# Altium schematic sheet AMC_uBACKPLANE.SchDoc: AMC uBACKPLANE
size 420 x 297 mm; Organization: Altium Limited; Address1: L3, 12a Rodborough Rd; Address2: Frenchs Forest; Address3: NSW; Address4: Australia 2086; DocumentNumber: 12; SheetNumber: 1; SheetTotal: 15
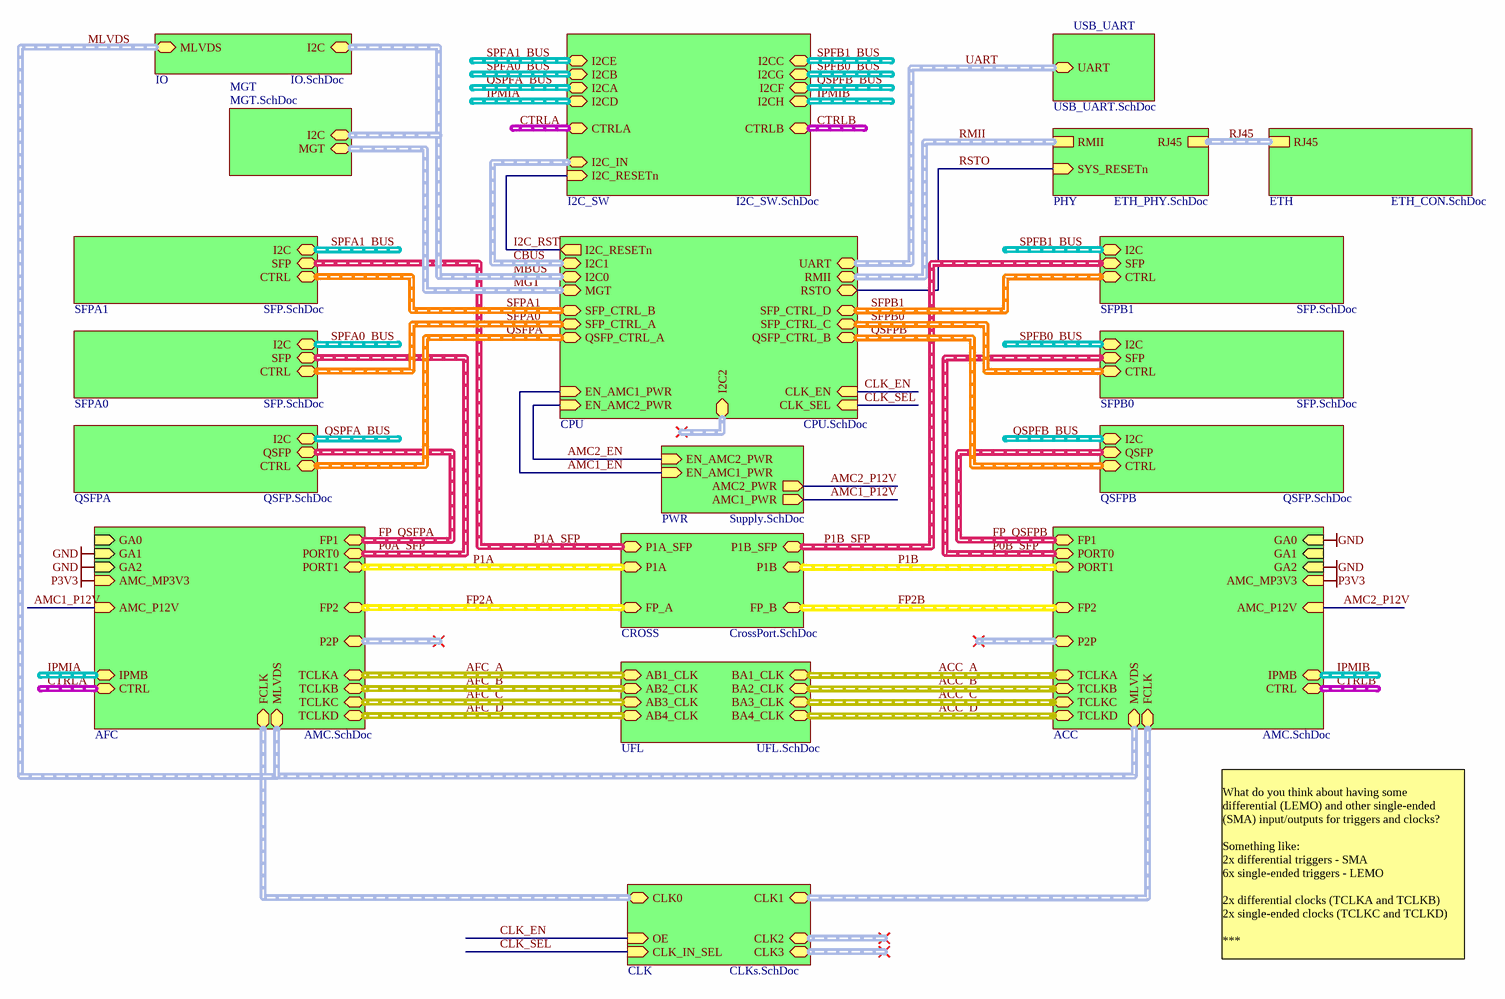
[diagram p0: AMC_uBACKPLANE.SchDoc]

## Sub-sheets
ACC = AMC.SchDoc: GA0 (in), GA1 (in), GA2 (in), MLVDS (harness TRG), PORT0 (harness 1xLane), FP2 (harness FP), PORT1 (harness 1xLane), FCLK (harness CLK_DF), TCLKA (harness CLK_DF), TCLKB (harness CLK_DF), TCLKC (harness CLK_DF), TCLKD (harness CLK_DF), FP1 (harness FP), AMC_P12V (in), AMC_MP3V3 (in), IPMB (harness I2C), CTRL (harness AMC_CTRL), P2P (harness P2P)
AFC = AMC.SchDoc: GA0 (in), GA1 (in), GA2 (in), MLVDS (harness TRG), PORT0 (harness 1xLane), FP2 (harness FP), PORT1 (harness 1xLane), FCLK (harness CLK_DF), TCLKA (harness CLK_DF), TCLKB (harness CLK_DF), TCLKC (harness CLK_DF), TCLKD (harness CLK_DF), FP1 (harness FP), AMC_P12V (in), AMC_MP3V3 (in), IPMB (harness I2C), CTRL (harness AMC_CTRL), P2P (harness P2P)
CLK = CLKs.SchDoc: CLK_IN_SEL (in), OE (in), CLK0 (harness CLK_DF), CLK1 (harness CLK_DF), CLK2 (harness CLK_DF), CLK3 (harness CLK_DF)
CPU = CPU.SchDoc: SFP_CTRL_A (harness SFP_CTRL), SFP_CTRL_B (harness SFP_CTRL), SFP_CTRL_C (harness SFP_CTRL), SFP_CTRL_D (harness SFP_CTRL), QSFP_CTRL_A (harness QSFP_CTRL), QSFP_CTRL_B (harness QSFP_CTRL), EN_AMC2_PWR (in), EN_AMC1_PWR (in), CLK_SEL (in), CLK_EN (in), I2C1 (harness I2C), I2C0 (harness I2C), I2C2 (harness I2C), UART (harness UART), RSTO, RMII (harness RMII), MGT (harness THERM_MGT), I2C_RESETn (out)
CROSS = CrossPort.SchDoc: FP_A (harness FP), FP_B (harness FP), P1A (harness 1xLane), P1A_SFP (harness 1xLane), P1B (harness 1xLane), P1B_SFP (harness 1xLane)
ETH = ETH_CON.SchDoc: RJ45 (harness MEDIA)
I2C_SW = I2C_SW.SchDoc: I2C_RESETn (in), I2CE (harness I2C), I2CB (harness I2C), I2CA (harness I2C), I2CD (harness I2C), I2CC (harness I2C), I2CG (harness I2C), I2CF (harness I2C), I2CH (harness I2C), I2C_IN (harness I2C), CTRLA (harness AMC_CTRL), CTRLB (harness AMC_CTRL)
IO = IO.SchDoc: MLVDS (harness MLVDS), I2C (harness I2C)
MGT = MGT.SchDoc: I2C (harness I2C), MGT (harness THERM_MGT)
PHY = ETH_PHY.SchDoc: RMII (harness RMII), RJ45 (harness MEDIA), SYS_RESETn (in)
PWR = Supply.SchDoc: AMC1_PWR (out), AMC2_PWR (out), EN_AMC1_PWR (in), EN_AMC2_PWR (in)
QSFPA = QSFP.SchDoc: I2C (harness I2C), QSFP (harness FP), CTRL (harness QSFP_CTRL)
QSFPB = QSFP.SchDoc: I2C (harness I2C), QSFP (harness FP), CTRL (harness QSFP_CTRL)
SFPA0 = SFP.SchDoc: I2C (harness I2C), SFP (harness 1xLane), CTRL (harness SFP_CTRL)
SFPA1 = SFP.SchDoc: I2C (harness I2C), SFP (harness 1xLane), CTRL (harness SFP_CTRL)
SFPB0 = SFP.SchDoc: I2C (harness I2C), SFP (harness 1xLane), CTRL (harness SFP_CTRL)
SFPB1 = SFP.SchDoc: I2C (harness I2C), SFP (harness 1xLane), CTRL (harness SFP_CTRL)
UFL = UFL.SchDoc: AB1_CLK (harness CLK_DF), BA1_CLK (harness CLK_DF), AB2_CLK (harness CLK_DF), BA2_CLK (harness CLK_DF), AB3_CLK (harness CLK_DF), BA3_CLK (harness CLK_DF), AB4_CLK (harness CLK_DF), BA4_CLK (harness CLK_DF)
USB_UART = USB_UART.SchDoc: UART (harness UART)

## Nets
GND: sheet ACC/GA0, sheet ACC/GA2, sheet AFC/GA1, sheet AFC/GA2
P3V3: sheet ACC/AMC_MP3V3, sheet AFC/AMC_MP3V3
AMC1_EN: sheet CPU/EN_AMC1_PWR, sheet PWR/EN_AMC1_PWR
AMC1_P12V: sheet AFC/AMC_P12V, sheet PWR/AMC1_PWR
AMC2_EN: sheet CPU/EN_AMC2_PWR, sheet PWR/EN_AMC2_PWR
AMC2_P12V: sheet ACC/AMC_P12V, sheet PWR/AMC2_PWR
CLK_EN: sheet CPU/CLK_EN, sheet CLK/OE
CLK_SEL: sheet CPU/CLK_SEL, sheet CLK/CLK_IN_SEL
I2C_RST: sheet CPU/I2C_RESETn, sheet I2C_SW/I2C_RESETn
RSTO: sheet CPU/RSTO, sheet PHY/SYS_RESETn

## Buses and harness runs
harness ACC_A = sheet ACC/TCLKA = sheet UFL/BA1_CLK
harness ACC_B = sheet ACC/TCLKB = sheet UFL/BA2_CLK
harness ACC_C = sheet ACC/TCLKC = sheet UFL/BA3_CLK
harness ACC_D = sheet ACC/TCLKD = sheet UFL/BA4_CLK
harness AFC_A = sheet AFC/TCLKA = sheet UFL/AB1_CLK
harness AFC_B = sheet AFC/TCLKB = sheet UFL/AB2_CLK
harness AFC_C = sheet AFC/TCLKC = sheet UFL/AB3_CLK
harness AFC_D = sheet AFC/TCLKD = sheet UFL/AB4_CLK
harness CBUS = sheet CPU/I2C1 = sheet I2C_SW/I2C_IN
harness CTRLA = sheet AFC/CTRL
harness CTRLA = sheet I2C_SW/CTRLA
harness CTRLB = sheet ACC/CTRL
harness CTRLB = sheet I2C_SW/CTRLB
harness FP2A = sheet AFC/FP2 = sheet CROSS/FP_A
harness FP2B = sheet ACC/FP2 = sheet CROSS/FP_B
harness FP_QSFPA = sheet AFC/FP1 = sheet QSFPA/QSFP
harness FP_QSFPB = sheet ACC/FP1 = sheet QSFPB/QSFP
harness IPMIA = sheet AFC/IPMB
harness IPMIA = sheet I2C_SW/I2CD
harness IPMIB = sheet ACC/IPMB
harness IPMIB = sheet I2C_SW/I2CH
harness MBUS = sheet CPU/I2C0 = sheet IO/I2C = sheet MGT/I2C
harness MGT = sheet CPU/MGT = sheet MGT/MGT
harness MLVDS = sheet ACC/MLVDS = sheet AFC/MLVDS = sheet IO/MLVDS
harness P0A_SFP = sheet AFC/PORT0 = sheet SFPA0/SFP
harness P0B_SFP = sheet ACC/PORT0 = sheet SFPB0/SFP
harness P1A = sheet AFC/PORT1 = sheet CROSS/P1A
harness P1A_SFP = sheet CROSS/P1A_SFP = sheet SFPA1/SFP
harness P1B = sheet ACC/PORT1 = sheet CROSS/P1B
harness P1B_SFP = sheet CROSS/P1B_SFP = sheet SFPB1/SFP
harness QSFPA = sheet CPU/QSFP_CTRL_A = sheet QSFPA/CTRL
harness QSFPB = sheet CPU/QSFP_CTRL_B = sheet QSFPB/CTRL
harness QSPFA_BUS = sheet I2C_SW/I2CA
harness QSPFA_BUS = sheet QSFPA/I2C
harness QSPFB_BUS = sheet I2C_SW/I2CF
harness QSPFB_BUS = sheet QSFPB/I2C
harness RJ45 = sheet ETH/RJ45 = sheet PHY/RJ45
harness RMII = sheet CPU/RMII = sheet PHY/RMII
harness SFPA0 = sheet CPU/SFP_CTRL_A = sheet SFPA0/CTRL
harness SFPA1 = sheet CPU/SFP_CTRL_B = sheet SFPA1/CTRL
harness SFPB0 = sheet CPU/SFP_CTRL_C = sheet SFPB0/CTRL
harness SFPB1 = sheet CPU/SFP_CTRL_D = sheet SFPB1/CTRL
harness sheet ACC/FCLK = sheet CLK/CLK1
harness sheet AFC/FCLK = sheet CLK/CLK0
harness SPFA0_BUS = sheet I2C_SW/I2CB
harness SPFA0_BUS = sheet SFPA0/I2C
harness SPFA1_BUS = sheet I2C_SW/I2CE
harness SPFA1_BUS = sheet SFPA1/I2C
harness SPFB0_BUS = sheet I2C_SW/I2CG
harness SPFB0_BUS = sheet SFPB0/I2C
harness SPFB1_BUS = sheet I2C_SW/I2CC
harness SPFB1_BUS = sheet SFPB1/I2C
harness UART = sheet CPU/UART = sheet USB_UART/UART

## Notes on the sheet
- What do you think about having some differential (LEMO) and other single-ended (SMA) input/outputs for triggers and clocks?
  Something like:
  2x differential triggers - SMA
  6x single-ended triggers - LEMO
  2x differential clocks (TCLKA and TCLKB)
  2x single-ended clocks (TCLKC and TCLKD)
  ***
  Some other things:
  - We can also have access to JTAG and I2C at the front panel.
  - 4x SFP cage could be connected to Port[0..3], as you said before.
  - About the enclosure, do you think it will be needed to design everything, or some parts from Schroff, ELMA, could be used?
- Project/Equipment
- Document
- uTCA RTM 8 SFP+
- Designer
- Drawn by
- Check.by
- Copyright Creotech Instruments SA 2014.
  This documentation describes Open Hardware and is licensed under the CERN OHL v.1.1. You may redistribute and modify this documentation under the terms of the CERN OHL v.1.1. (http://ohwr.org/CERNOHL). This documentation is distributed WITHOUT ANY EXPRESS OR IMPLIED WARRANTY, INCLUDING OF MERCHANTABILITY, SATISFACTORY QUALITY AND FITNESS FOR A PARTICULAR PURPOSE. Please see the CERN OHL v.1.1 for applicable conditions.
- Creotech Instruments S.A.
- File
- Last Mod.
- Print Date
- Sheet
- Size
- A3
- of
- Rev